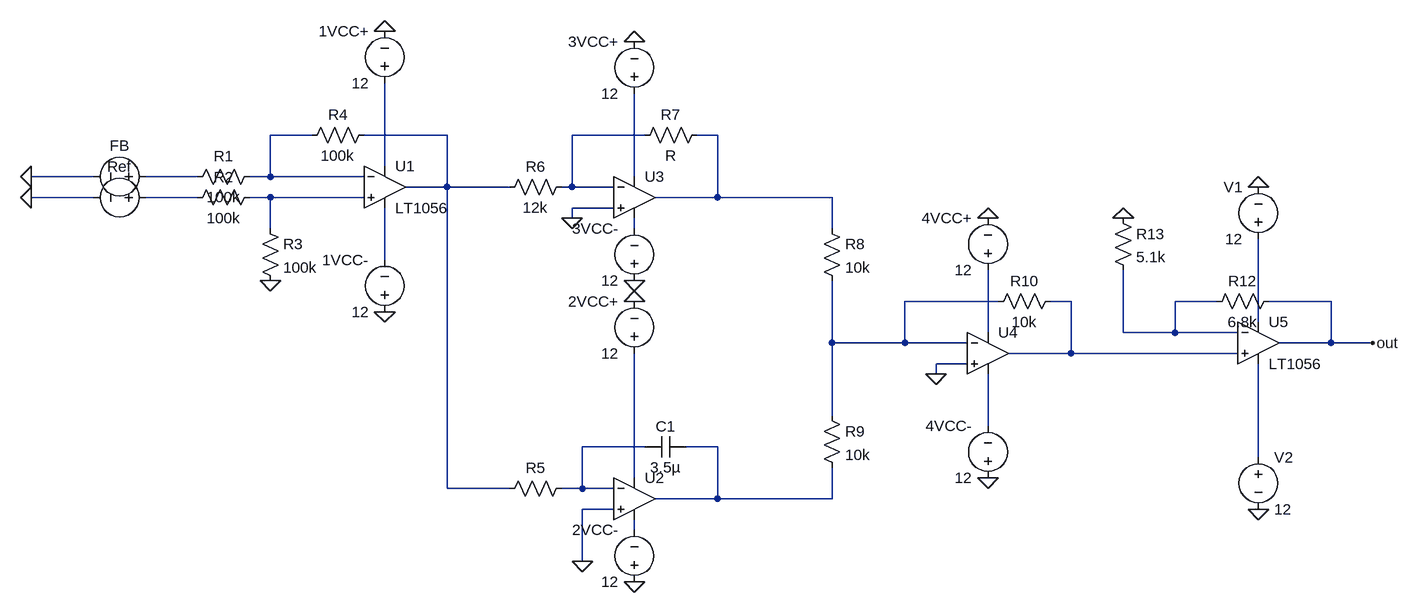
[diagram p0: schematic PI-controller.asc]
PI-controller.asc, the LTspice schematic file:
Version 4
SHEET 1 2056 760
WIRE 304 32 240 32
WIRE 512 32 384 32
WIRE 816 32 704 32
WIRE 928 32 896 32
WIRE 416 80 416 -48
WIRE -32 96 -128 96
WIRE 128 96 48 96
WIRE 240 96 240 32
WIRE 240 96 208 96
WIRE 384 96 240 96
WIRE 800 96 800 -32
WIRE 512 112 512 32
WIRE 512 112 448 112
WIRE 608 112 512 112
WIRE 704 112 704 32
WIRE 704 112 688 112
WIRE 768 112 704 112
WIRE -32 128 -128 128
WIRE 128 128 48 128
WIRE 240 128 208 128
WIRE 384 128 240 128
WIRE 928 128 928 32
WIRE 928 128 832 128
WIRE 1104 128 928 128
WIRE 768 144 704 144
WIRE 704 160 704 144
WIRE 240 176 240 128
WIRE 800 176 800 160
WIRE 1104 176 1104 128
WIRE 416 224 416 144
WIRE 1360 288 1216 288
WIRE 1472 288 1440 288
WIRE 1696 288 1632 288
WIRE 1872 288 1776 288
WIRE 1760 320 1760 192
WIRE 1344 336 1344 240
WIRE 1552 336 1552 240
WIRE 1632 336 1632 288
WIRE 1632 336 1552 336
WIRE 1728 336 1632 336
WIRE 1104 352 1104 256
WIRE 1216 352 1216 288
WIRE 1216 352 1104 352
WIRE 1312 352 1216 352
WIRE 1872 352 1872 288
WIRE 1872 352 1792 352
WIRE 1936 352 1872 352
WIRE 1472 368 1472 288
WIRE 1472 368 1376 368
WIRE 1728 368 1472 368
WIRE 1312 384 1264 384
WIRE 1264 400 1264 384
WIRE 1104 464 1104 352
WIRE 1344 480 1344 400
WIRE 816 512 720 512
WIRE 928 512 880 512
WIRE 1760 528 1760 384
WIRE 800 560 800 368
WIRE 512 576 512 112
WIRE 608 576 512 576
WIRE 720 576 720 512
WIRE 720 576 688 576
WIRE 768 576 720 576
WIRE 928 592 928 512
WIRE 928 592 832 592
WIRE 1104 592 1104 544
WIRE 1104 592 928 592
WIRE 768 608 720 608
WIRE 800 640 800 624
WIRE 720 688 720 608
FLAG 240 256 0
FLAG 416 304 0
FLAG -128 128 0
FLAG -128 96 0
FLAG 720 688 0
FLAG 704 160 0
FLAG 800 256 0
FLAG 800 720 0
FLAG 800 -112 0
FLAG 1264 400 0
FLAG 1344 160 0
FLAG 1344 560 0
FLAG 416 -128 0
FLAG 1760 112 0
FLAG 1760 608 0
FLAG 1552 160 0
FLAG 1936 352 out
FLAG 800 288 0
SYMBOL res 224 80 R90
WINDOW 0 0 56 VBottom 2
WINDOW 3 32 56 VTop 2
SYMATTR InstName R1
SYMATTR Value 100k
SYMBOL res 224 112 R90
WINDOW 0 0 56 VBottom 2
WINDOW 3 32 56 VTop 2
SYMATTR InstName R2
SYMATTR Value 100k
SYMBOL res 224 160 R0
SYMATTR InstName R3
SYMATTR Value 100k
SYMBOL voltage 416 -32 R180
WINDOW 0 24 96 Left 2
WINDOW 3 24 16 Left 2
WINDOW 123 0 0 Left 0
WINDOW 39 0 0 Left 0
SYMATTR InstName 1VCC+
SYMATTR Value 12
SYMBOL voltage 416 320 R180
WINDOW 0 24 96 Left 2
WINDOW 3 24 16 Left 2
WINDOW 123 0 0 Left 0
WINDOW 39 0 0 Left 0
SYMATTR InstName 1VCC-
SYMATTR Value 12
SYMBOL voltage 64 96 R90
WINDOW 0 -32 56 VBottom 2
WINDOW 3 32 56 VTop 2
SYMATTR InstName FB
SYMATTR Value ""
SYMBOL voltage 64 128 R90
WINDOW 0 -32 56 VBottom 2
WINDOW 3 32 56 VTop 2
SYMATTR InstName Ref
SYMATTR Value ""
SYMBOL res 400 16 R90
WINDOW 0 0 56 VBottom 2
WINDOW 3 32 56 VTop 2
SYMATTR InstName R4
SYMATTR Value 100k
SYMBOL res 704 560 R90
WINDOW 0 0 56 VBottom 2
WINDOW 3 32 56 VTop 2
SYMATTR InstName R5
SYMATTR Value ""
SYMBOL OpAmps\\UniversalOpamp2 800 592 R0
SYMATTR InstName U2
SYMBOL res 704 96 R90
WINDOW 0 0 56 VBottom 2
WINDOW 3 32 56 VTop 2
SYMATTR InstName R6
SYMATTR Value 12k
SYMBOL OpAmps\\UniversalOpamp2 800 128 R0
SYMATTR InstName U3
SYMBOL voltage 800 384 R180
WINDOW 0 24 96 Left 2
WINDOW 3 24 16 Left 2
SYMATTR InstName 2VCC+
SYMATTR Value 12
SYMBOL voltage 800 272 R180
WINDOW 0 24 96 Left 2
WINDOW 3 24 16 Left 2
SYMATTR InstName 3VCC-
SYMATTR Value 12
SYMBOL voltage 800 736 R180
WINDOW 0 24 96 Left 2
WINDOW 3 24 16 Left 2
SYMATTR InstName 2VCC-
SYMATTR Value 12
SYMBOL voltage 800 -16 R180
WINDOW 0 24 96 Left 2
WINDOW 3 24 16 Left 2
SYMATTR InstName 3VCC+
SYMATTR Value 12
SYMBOL res 912 16 R90
WINDOW 0 0 56 VBottom 2
WINDOW 3 32 56 VTop 2
SYMATTR InstName R7
SYMBOL res 1088 160 R0
SYMATTR InstName R8
SYMATTR Value 10k
SYMBOL res 1088 448 R0
SYMATTR InstName R9
SYMATTR Value 10k
SYMBOL OpAmps\\UniversalOpamp2 1344 368 R0
SYMATTR InstName U4
SYMBOL voltage 1344 256 R180
WINDOW 0 24 96 Left 2
WINDOW 3 24 16 Left 2
SYMATTR InstName 4VCC+
SYMATTR Value 12
SYMBOL voltage 1344 576 R180
WINDOW 0 24 96 Left 2
WINDOW 3 24 16 Left 2
SYMATTR InstName 4VCC-
SYMATTR Value 12
SYMBOL res 1456 272 R90
WINDOW 0 0 56 VBottom 2
WINDOW 3 32 56 VTop 2
SYMATTR InstName R10
SYMATTR Value 10k
SYMBOL OpAmps\\LT1056 416 48 R0
SYMATTR InstName U1
SYMBOL OpAmps\\LT1056 1760 288 R0
SYMATTR InstName U5
SYMBOL voltage 1760 208 R180
WINDOW 0 24 96 Left 2
WINDOW 3 24 16 Left 2
SYMATTR InstName V1
SYMATTR Value 12
SYMBOL voltage 1760 512 R0
SYMATTR InstName V2
SYMATTR Value 12
SYMBOL res 1792 272 R90
WINDOW 0 0 56 VBottom 2
WINDOW 3 32 56 VTop 2
SYMATTR InstName R12
SYMATTR Value 6.8k
SYMBOL res 1536 144 R0
SYMATTR InstName R13
SYMATTR Value 5.1k
SYMBOL cap 880 496 R90
WINDOW 0 0 32 VBottom 2
WINDOW 3 32 32 VTop 2
SYMATTR InstName C1
SYMATTR Value 3.5µ

The netlist it stands for:
* PI-controller.asc
R1 N001 N006 100k
R2 N009 N008 100k
R3 N009 0 100k
V§1VCC+ N005 0 12
V§1VCC- 0 N011 12
V§FB N006 0
V§Ref N008 0
R4 N002 N001 100k
R5 N018 N002
XU2 0 N018 N021 N022 N019 level.2 Avol=1Meg GBW=10Meg Slew=10Meg ilimit=25m rail=0 Vos=0 phimargin=45 en=0 enk=0 in=0 ink=0 Rin=500Meg  ; pins IN+ IN- V+ V- OUT
R6 N003 N002 12k
XU3 0 N003 N007 N010 N004 level.2 Avol=1Meg GBW=10Meg Slew=10Meg ilimit=25m rail=0 Vos=0 phimargin=45 en=0 enk=0 in=0 ink=0 Rin=500Meg  ; pins IN+ IN- V+ V- OUT
V§2VCC+ N021 0 12
V§3VCC- 0 N010 12
V§2VCC- 0 N022 12
V§3VCC+ N007 0 12
R7 N004 N003 R
R8 N004 N012 10k
R9 N012 N019 10k
XU4 0 N012 N016 N017 N013 level.2 Avol=1Meg GBW=10Meg Slew=10Meg ilimit=25m rail=0 Vos=0 phimargin=45 en=0 enk=0 in=0 ink=0 Rin=500Meg  ; pins IN+ IN- V+ V- OUT
V§4VCC+ N016 0 12
V§4VCC- 0 N017 12
R10 N013 N012 10k
XU1 N009 N001 N005 N011 N002 LT1056  ; pins In+ In- V+ V- OUT
XU5 N013 N014 N015 N020 out LT1056  ; pins In+ In- V+ V- OUT
V1 N015 0 12
V2 N020 0 12
R12 out N014 6.8k
R13 0 N014 5.1k
C1 N019 N018 3.5µ
.lib UniversalOpamps2.sub
.backanno
.end